# Altium schematic sheet Sweep Oscillator.SchDoc
size Tabloid
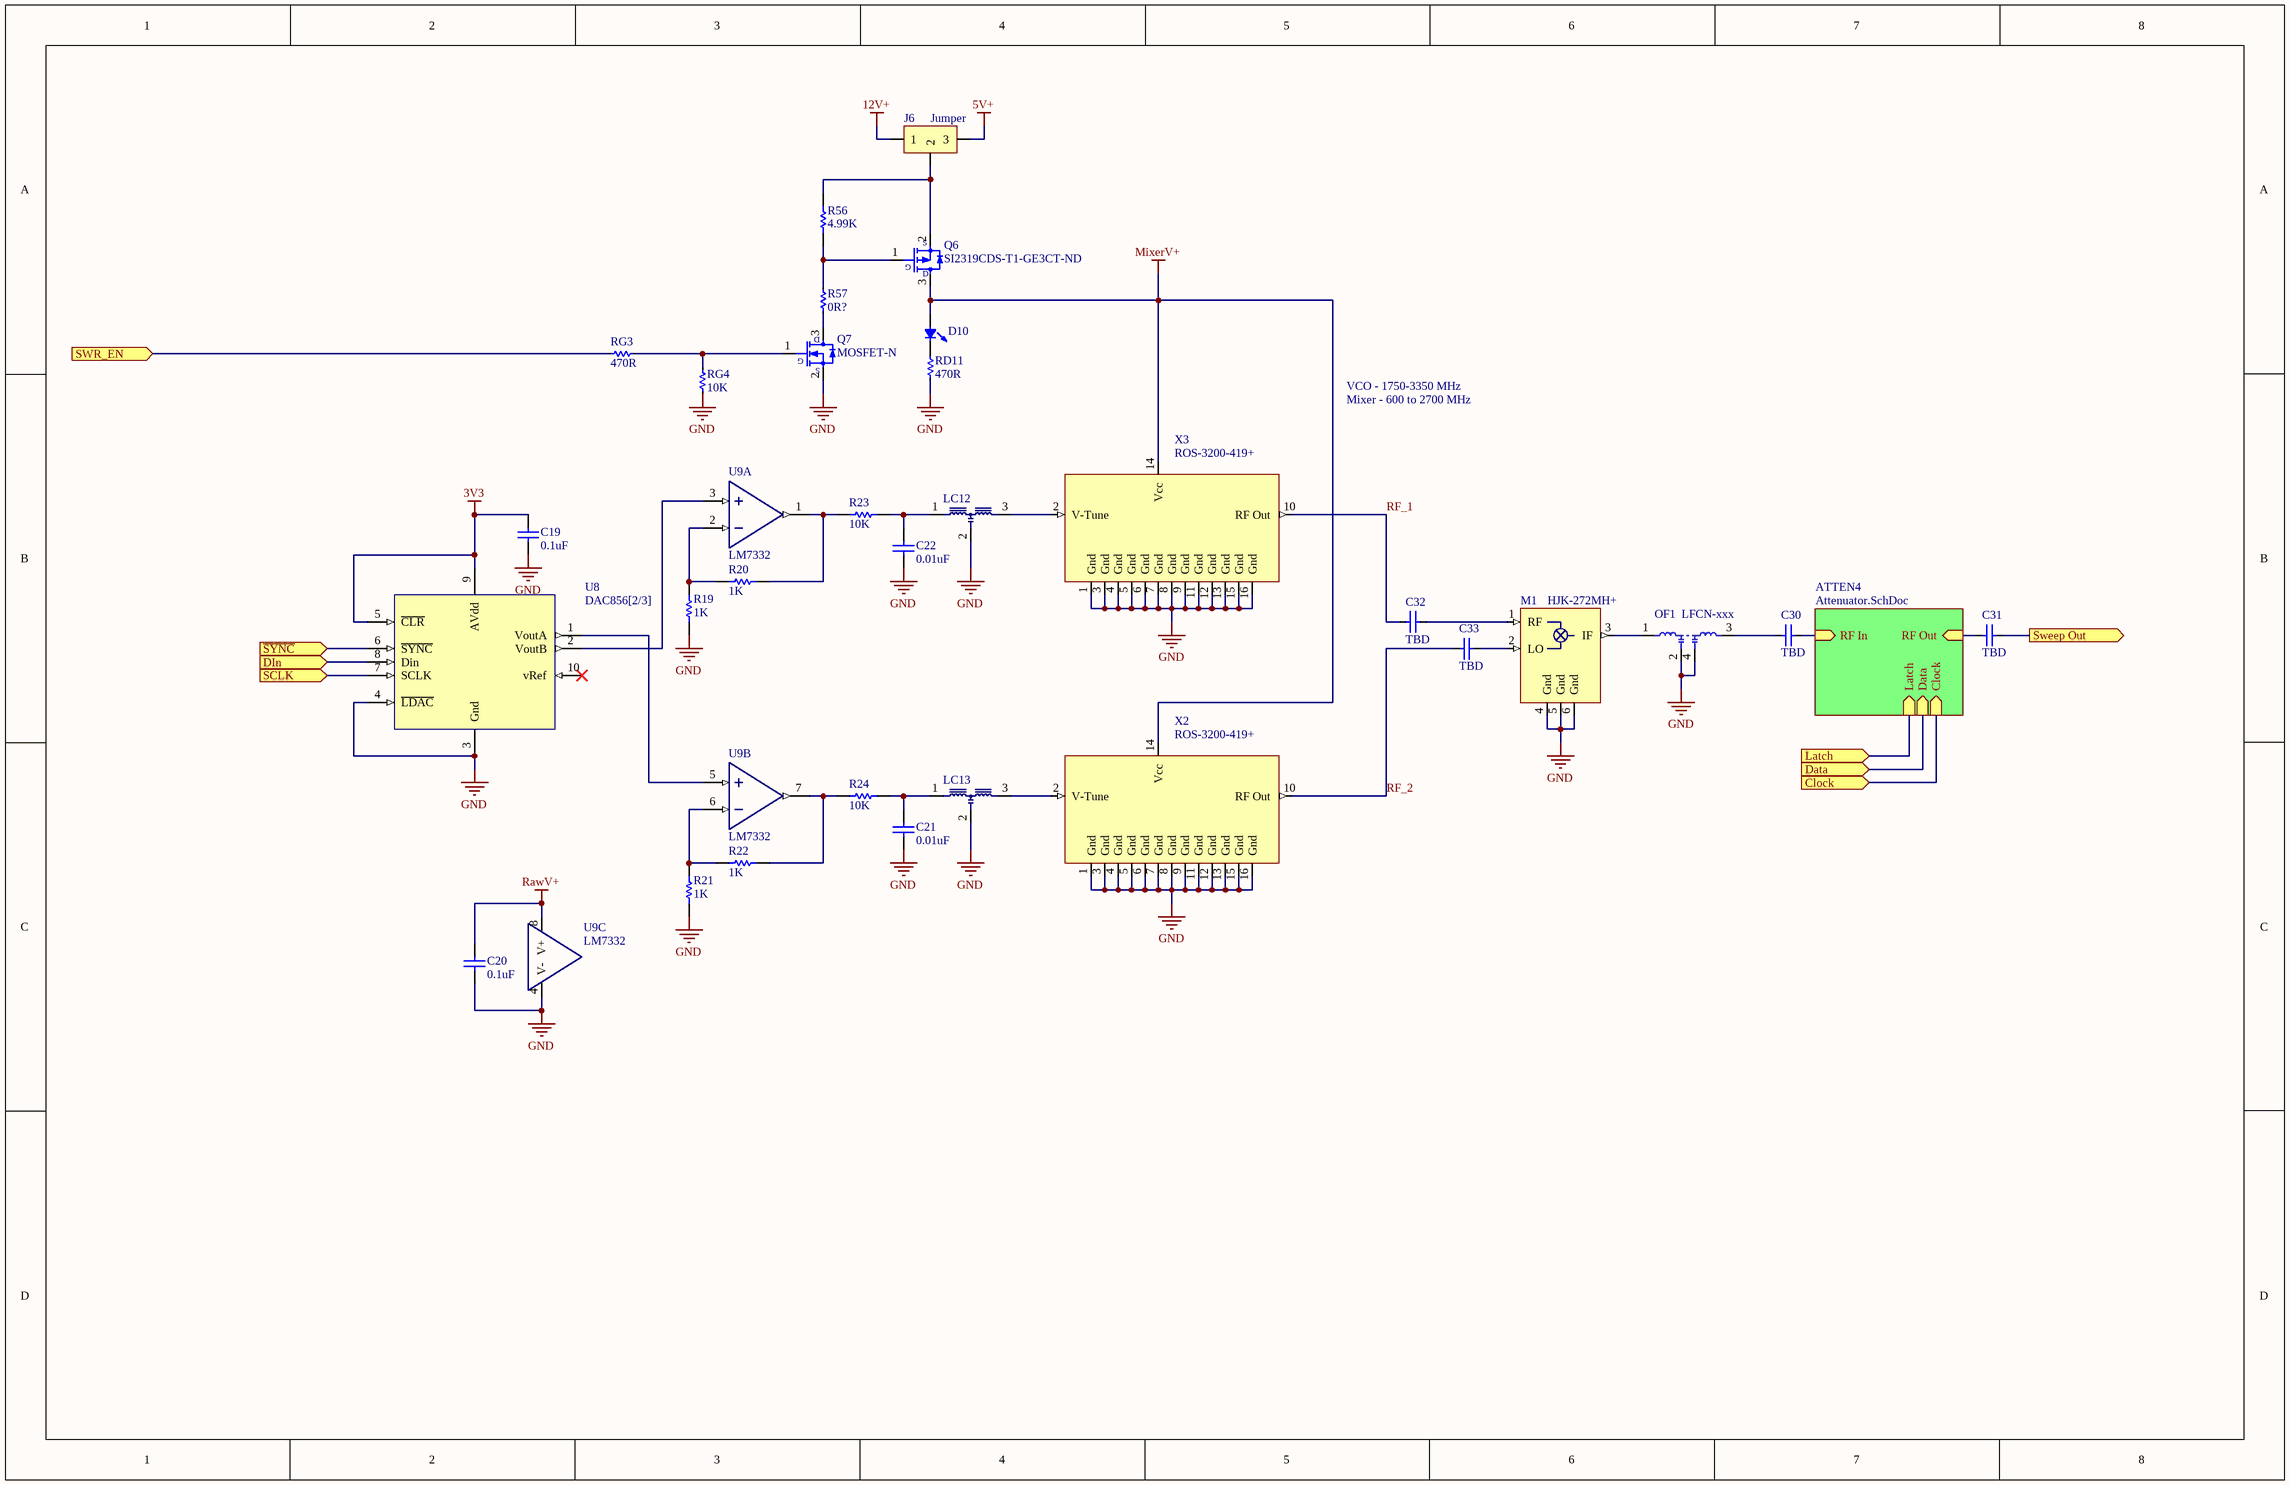
[diagram p0: Sweep Oscillator.SchDoc]

## Parts
C19  value 0.1uF  [0603C]  (hidden comment: Cap Semi)
C20  value 0.1uF  [0603C]  (hidden comment: Cap Semi)
C21  value 0.01uF  [0603C]  (hidden comment: Cap Semi)
C22  value 0.01uF  [0603C]  (hidden comment: Cap Semi)
C30  value TBD  [0402C]  (hidden comment: Cap)
C31  value TBD  [0402C]  (hidden comment: Cap)
C32  value TBD  [0402C]  (hidden comment: Cap)
C33  value TBD  [0402C]  (hidden comment: Cap)
D10  LED0  [0603 SMT LED]  (value not drawn)
J6  Jumper  [HDR1X3]
LC12  MEM2012F  [MEM2012S LC Filter]  (value not drawn)
LC13  MEM2012F  [MEM2012S LC Filter]  (value not drawn)
M1  HJK-272MH+  [TTT881]
OF1  LFCN-xxx  [FV1206]
Q6  SI2319CDS-T1-GE3CT-ND  [SOT23-3N]
Q7  MOSFET-N  [SOT23-3N]
R19  value 1K  [0603R]  (hidden comment: Res Semi)
R20  value 1K  [0603R]  (hidden comment: Res Semi)
R21  value 1K  [0603R]  (hidden comment: Res Semi)
R22  value 1K  [0603R]  (hidden comment: Res Semi)
R23  value 10K  [0603R]  (hidden comment: Res Semi)
R24  value 10K  [0603R]  (hidden comment: Res Semi)
R56  value 4.99K  [0603R]  (hidden comment: Res Semi)
R57  value 0R?  [0603R]  (hidden comment: Res Semi Small)
RD11  value 470R  [0603R]  (hidden comment: Res Semi Small)
RG3  value 470R  [0603R]  (hidden comment: Res Semi Small)
RG4  value 10K  [0603R]  (hidden comment: Res Semi Small)
U8  DAC856[2/3]  [TSSOP50P490-10AN]
U9  LM7332  [SOIC127P600-8CN]  (parts A,B,C of 3)
X2  ROS-3200-419+  [CK605]
X3  ROS-3200-419+  [CK605]

## Sub-sheets
ATTEN4 = Attenuator.SchDoc: RF In (in), RF Out (in), Clock (in), Data (in), Latch (in)

## Ports
Clock (in), Data (in), DIn (in), Latch (in), SCLK (in), Sweep Out (out), SWR_EN (in), ~{SYNC} (in)

## Nets
3V3: C19.2 U8.5(~{CLR}) U8.9(AVdd)
5V+: J6.3
12V+: J6.1
GND: C19.1 C20.1 C21.1 C22.1 LC12.2 LC13.2 M1.4(Gnd) M1.5(Gnd) M1.6(Gnd) OF1.2 OF1.4 Q7.2(S) R19.2 R21.1 RD11.2 RG4.1 U8.3(Gnd) U8.4(~{LDAC}) U9.4(V-) X2.1(Gnd) X2.3(Gnd) X2.4(Gnd) X2.5(Gnd) X2.6(Gnd) X2.7(Gnd) X2.8(Gnd) X2.9(Gnd) X2.11(Gnd) X2.12(Gnd) X2.13(Gnd) X2.15(Gnd) X2.16(Gnd) X3.1(Gnd) X3.3(Gnd) X3.4(Gnd) X3.5(Gnd) X3.6(Gnd) X3.7(Gnd) X3.8(Gnd) X3.9(Gnd) X3.11(Gnd) X3.12(Gnd) X3.13(Gnd) X3.15(Gnd) X3.16(Gnd)
MixerV+: D10.1 Q6.3(S) X2.14(Vcc) X3.14(Vcc)
RawV+: C20.2 U9.8(V+)
~{SYNC}: U8.6(~{SYNC}) ; port ~{SYNC}
Clock: port Clock, sheet ATTEN4/Clock
Data: port Data, sheet ATTEN4/Data
DIn: U8.8(Din) ; port DIn
Latch: port Latch, sheet ATTEN4/Latch
RF_1: C32.1 X3.10(RF_Out)
RF_2: C33.1 X2.10(RF_Out)
SCLK: U8.7(SCLK) ; port SCLK
Sweep Out: C31.2 ; port Sweep Out
SWR_EN: RG3.1 ; port SWR_EN
NetC21_2: C21.2 LC13.1 R24.1
NetC22_2: C22.2 LC12.1 R23.1
NetC30_1: C30.1 OF1.3
NetC30_2: C30.2 ; sheet ATTEN4/RF In
NetC31_1: C31.1 ; sheet ATTEN4/RF Out
NetC32_2: C32.2 M1.1(RF)
NetC33_2: C33.2 M1.2(LO)
NetD10_2: D10.2 RD11.1
NetJ6_2: J6.2 Q6.2(D) R56.2
NetLC12_3: LC12.3 X3.2(V-Tune)
NetLC13_3: LC13.3 X2.2(V-Tune)
NetM1_3: M1.3(IF) OF1.1
NetQ6_1: Q6.1(G) R56.1 R57.1
NetQ7_1: Q7.1(G) RG3.2 RG4.2
NetQ7_3: Q7.3(D) R57.2
NetR19_1: R19.1 R20.1 U9.2(In_A_-)
NetR20_2: R20.2 R23.2 U9.1(Out_A)
NetR21_2: R21.2 R22.2 U9.6(In_B_-)
NetR22_1: R22.1 R24.2 U9.7(Out_B)
NetU8_1: U8.1(VoutA) U9.5(In_B_+)
NetU8_2: U8.2(VoutB) U9.3(In_A_+)

Not connected (* = marked no-connect by the designer): U8 10(vRef)*

## Notes on the sheet
- VCO - 1750-3350 MHz
- Mixer - 600 to 2700 MHz

## Library data of the parts
C19-C22 = Cap Semi: Capacitor (Semiconductor SIM Model); Published: 8-Jun-2000; LatestRevisionDate: 17-Jul-2002; LatestRevisionNote: Re-released for DXP Platform.; PackageReference: C1206; Publisher: Altium Limited
C30-C33 = Cap: Capacitor; Published: 8-Jun-2000; LatestRevisionDate: 17-Jul-2002; LatestRevisionNote: Re-released for DXP Platform.; PackageReference: RAD-0.3; Publisher: Altium Limited
D10 = LED0: T 1 3/4 LED; Published: 8-Jun-2000; LatestRevisionDate: 08-Jul-2005; LatestRevisionNote: Mech Layer 1 removed.; PackageReference: LED-0; Publisher: Altium Limited
J6 = Jumper - 3 Pin: Jumper - 3-Pin; LatestRevisionDate: 17-Jul-2002; LatestRevisionNote: Re-released for DXP Platform.; Publisher: Altium Limited
LC12 LC13 = MEM2012F - Signal Filter: Signal Line 3-terminal Filters
M1 = HJK-272MH+: Wideband Frequency Mixer Level 13 (LO Power +13 dBm) 600 to 2700 MHz
OF1 = LFCN-xxx Filter: Ceramic Low Pass Filter
Q6 = MOSFET-P: P-Channel MOSFET; Published: 8-Jun-2000; LatestRevisionDate: 17-Jul-2002; LatestRevisionNote: Re-released for DXP Platform.; PackageVersion: 1995/1996; PackageReference: E3; Publisher: Altium Limited
Q7 = MOSFET-N: N-Channel MOSFET; Published: 8-Jun-2000; LatestRevisionDate: 17-Jul-2002; LatestRevisionNote: Re-released for DXP Platform.; PackageVersion: 1995/1996; PackageReference: E3; Publisher: Altium Limited
R19-R24 R56 = Res Semi: Semiconductor Resistor; Published: 8-Jun-2000; LatestRevisionDate: 17-Jul-2002; LatestRevisionNote: Re-released for DXP Platform.; PackageReference: AXIAL-0.5; Publisher: Altium Limited
R57 RD11 RG3 RG4 = Res Semi Small: Semiconductor Resistor; Published: 8-Jun-2000; LatestRevisionDate: 17-Jul-2002; LatestRevisionNote: Re-released for DXP Platform.; PackageReference: AXIAL-0.5; Publisher: Altium Limited
U8 = DAC856[2/3]: 16-Bit, Dual, Low Power, Ultra-low Glitch, Buffered Voltage Output DAC with 2.5V, 4ppm/°C Reference; DKPN: 296-32089-1-ND
U9 = LM7332: Dual Rail-to-Rail Input/Output, 30V, Wide Voltage Range, High Output Operational Amplifier; Datasheet: http://www.analog.com/static/imported-files/data_sheets/AD822.pdf
X2 X3 = ROS-2650 VCO: Linear Tuning 2165 to 2650 MHz SMT Voltage Controlled Oscillator